# Altium schematic sheet Isolated_Power_supply.SchDoc: Power Supply (part 3 of 3)
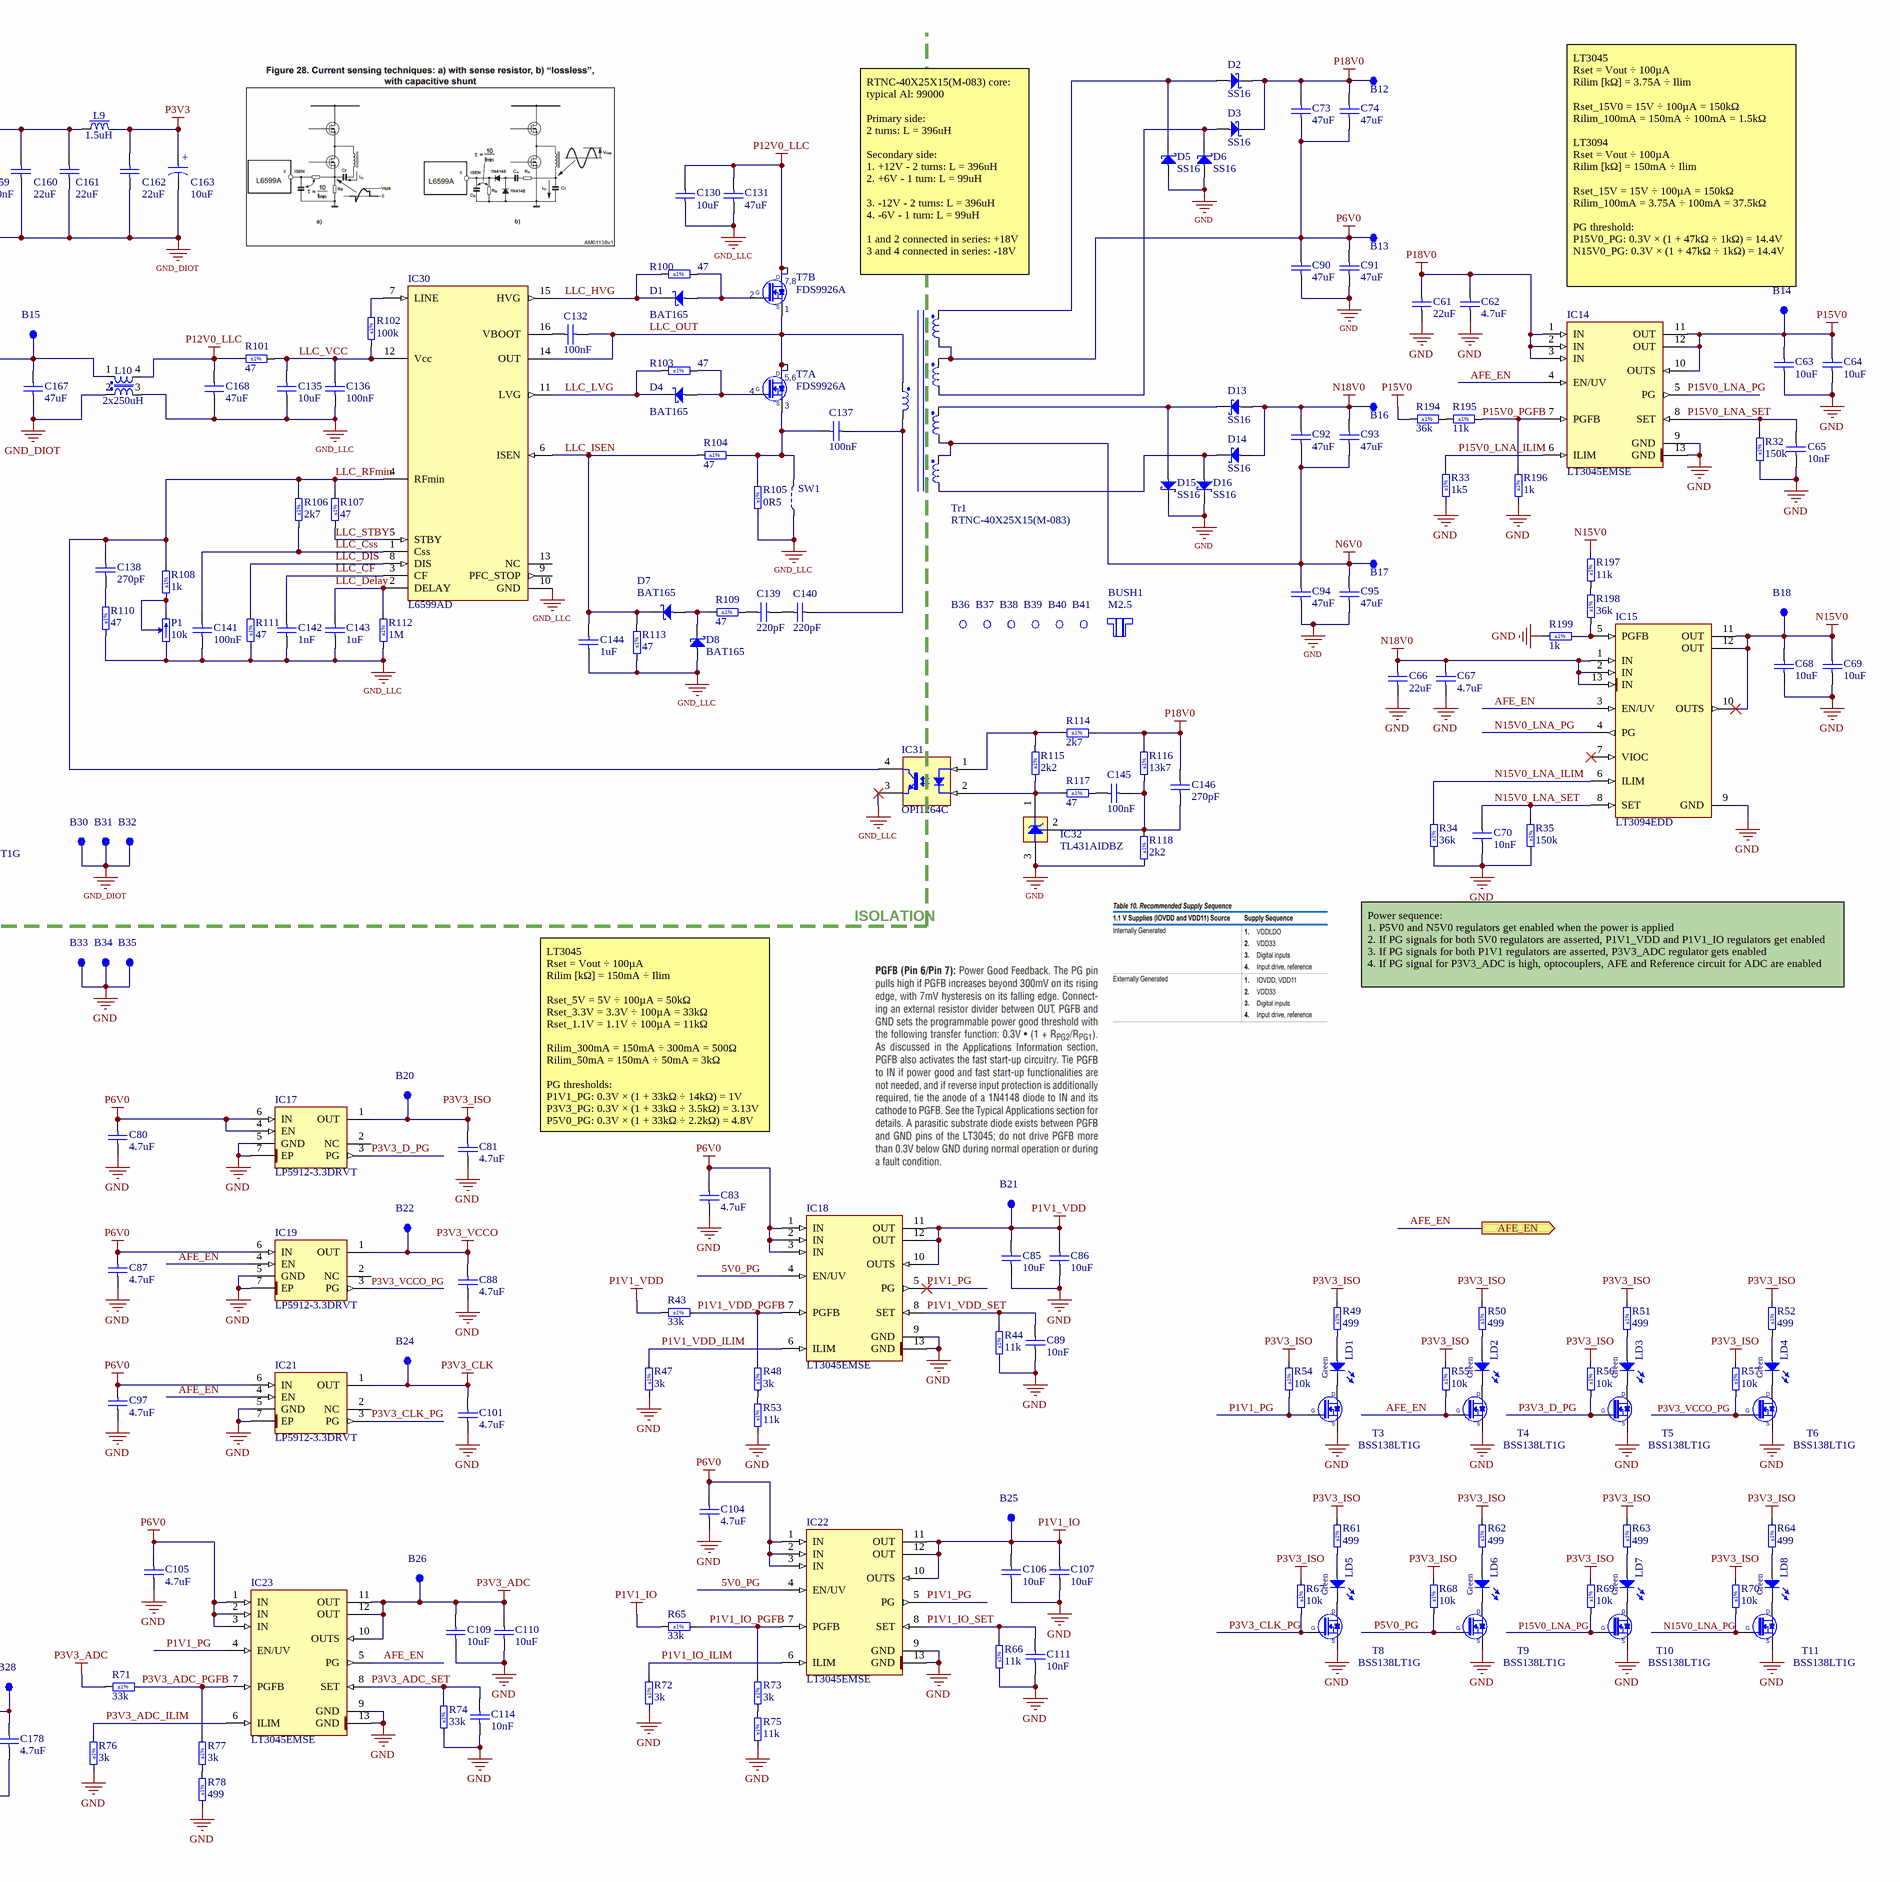
[diagram p3: Isolated_Power_supply.SchDoc, right]

## Library data of the parts (continued)
Tr1 = CORE_RTNC-40X25X15(M-083): Toroidal Core with 5 Windings; Part Description: 40x25x15mm AL=99000 Nanoperm Core; Manufacturer: Feryster; Part Number: CORE_RTNC-40X25X15(M-083); Component Kind: Standard; Component Type: Standard; Pin Count: 10; Value: RTNC-40X25X15(M-083); Current: N/A; DC Resistance: N/A; Tolerance: N/A; Manufacturer Part Number: RTNC-40X25X15(M-083); Status: Active; ComponentHeight: 15mm; SMD: No; Author: Michal Beldyga; CreateDate: 2/14/2025; LatestRevisionDate: 2/14/2025